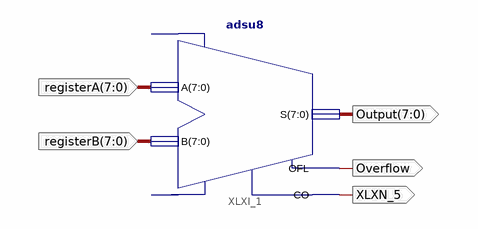
[diagram p0: schematic sheet 1]
// Xilinx ISE schematic ALU.sch (spartan3e) as structural Verilog: 1 symbols, 5 ports
module ALU (
  input  [7:0] registerA,
  input  [7:0] registerB,
  output [7:0] Output,
  output Overflow,
  output XLXN_5
);

  adsu8 XLXI_1 (.A(registerA), .B(registerB), .CO(XLXN_5), .OFL(Overflow), .S(Output));  // open: ADD, CI
endmodule
